# EAGLE design boomdsp (EAGLE 8.1.0)

## Sheet 1 of 2
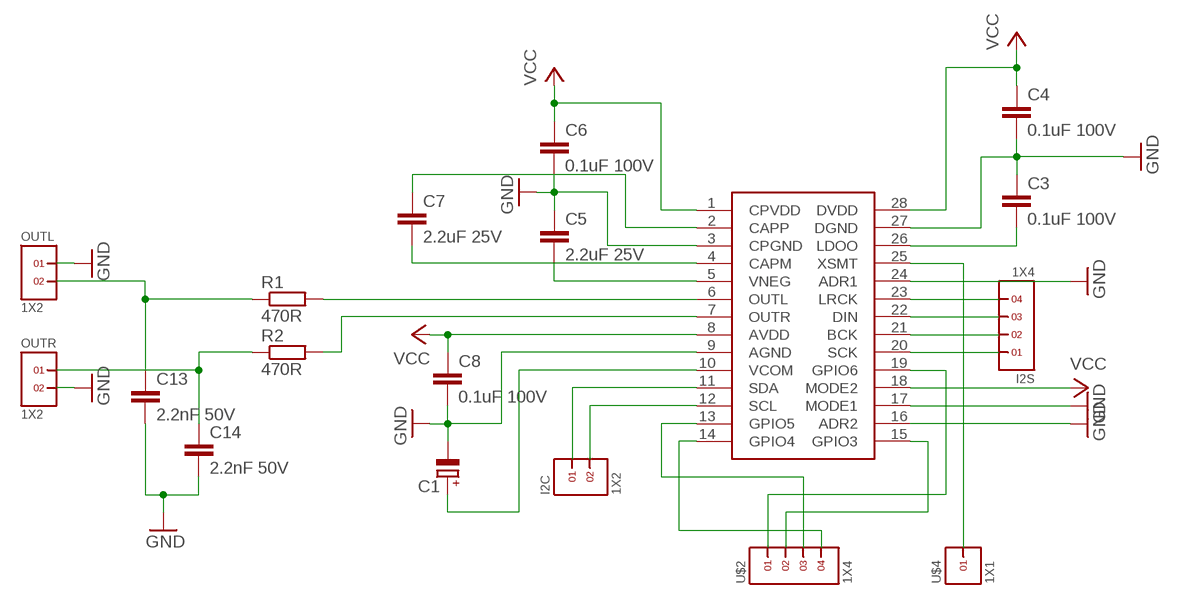
[diagram p0: schematic, sheet 1]

### Parts
C1  CPOL-EUE3.5-8  [E3,5-8]
C3  0.1uF 100V  C-EUC0805  [C0805]
C4  0.1uF 100V  C-EUC0805  [C0805]
C5  2.2uF 25V  C-EUC0805  [C0805]
C6  0.1uF 100V  C-EUC0805  [C0805]
C7  2.2uF 25V  C-EUC0805  [C0805]
C8  0.1uF 100V  C-EUC0805  [C0805]
C13  2.2nF 50V  C-EU102-043X133  [C102-043X133]
C14  2.2nF 50V  C-EU102-043X133  [C102-043X133]
I2C  1X2  [1X2]
I2S  1X4  [1X4]
OUTL  1X2  [1X2]
OUTR  1X2  [1X2]
R1  470R  R-EU_R0805  [R0805]
R2  470R  R-EU_R0805  [R0805]
U$1  PCM5142_I2C  [TSSOP28]
U$2  1X4  [1X4]
U$4  1X1  [1X1]

### Nets
GND: C1.- C3.1 C4.2 C5.1 C6.2 C8.2 C13.2 C14.2 OUTL.1 OUTR.2 U$1.3(CPGND) U$1.9(AGND) U$1.16(ADR2) U$1.24(ADR1) U$1.27(DGND) ; also sheet 2
N$1: R1.2 U$1.6(OUTL)
N$2: R2.2 U$1.7(OUTR)
N$3: C14.1 OUTR.1 R2.1
N$4: C13.1 OUTL.2 R1.1
N$5: C7.2 U$1.4(CAPM)
N$6: C3.2 U$1.26(LDOO)
N$7: U$1.15(GPIO3) U$2.2
N$8: U$1.14(GPIO4) U$2.4
N$9: C5.2 U$1.5(VNEG)
N$10: U$1.13(GPIO5) U$2.3
N$11: U$1.19(GPIO6) U$2.1
N$12: C7.1 U$1.2(CAPP)
N$13: I2S.4 U$1.23(LRCK)
N$14: I2S.3 U$1.22(DIN)
N$15: C1.+ U$1.10(VCOM)
N$16: I2S.2 U$1.21(BCK)
N$17: I2S.1 U$1.20(SCK)
N$18: U$1.17(MODE1) ; supply symbol labelled GND
N$19: I2C.1 U$1.11(SDA)
N$20: I2C.2 U$1.12(SCL)
N$21: U$1.25(XSMT) U$4.1
VCC: C4.1 C6.1 C8.1 U$1.1(CPVDD) U$1.8(AVDD) U$1.18(MODE2) U$1.28(DVDD) ; also sheet 2

## Sheet 2 of 2
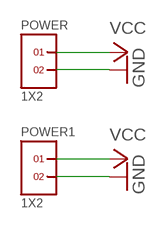
[diagram p1: schematic, sheet 2]

### Parts
POWER  1X2  [1X2]
POWER1  1X2  [1X2]

### Nets
GND: POWER1.2 POWER.2 ; also sheet 1
VCC: POWER1.1 POWER.1 ; also sheet 1

## Library data of the parts
C1 = rcl:CPOL-EU: POLARIZED CAPACITOR, European symbol
C3-C8 C13 C14 = rcl:C-EU: CAPACITOR, European symbol
I2C OUTL OUTR POWER POWER1 = headers(2mm):1X2
I2S U$2 = headers(2mm):1X4
R1 R2 = rcl:R-EU_: RESISTOR, European symbol
U$1 = boomdsp:PCM5142_I2C
U$4 = headers(2mm):1X1

## Board
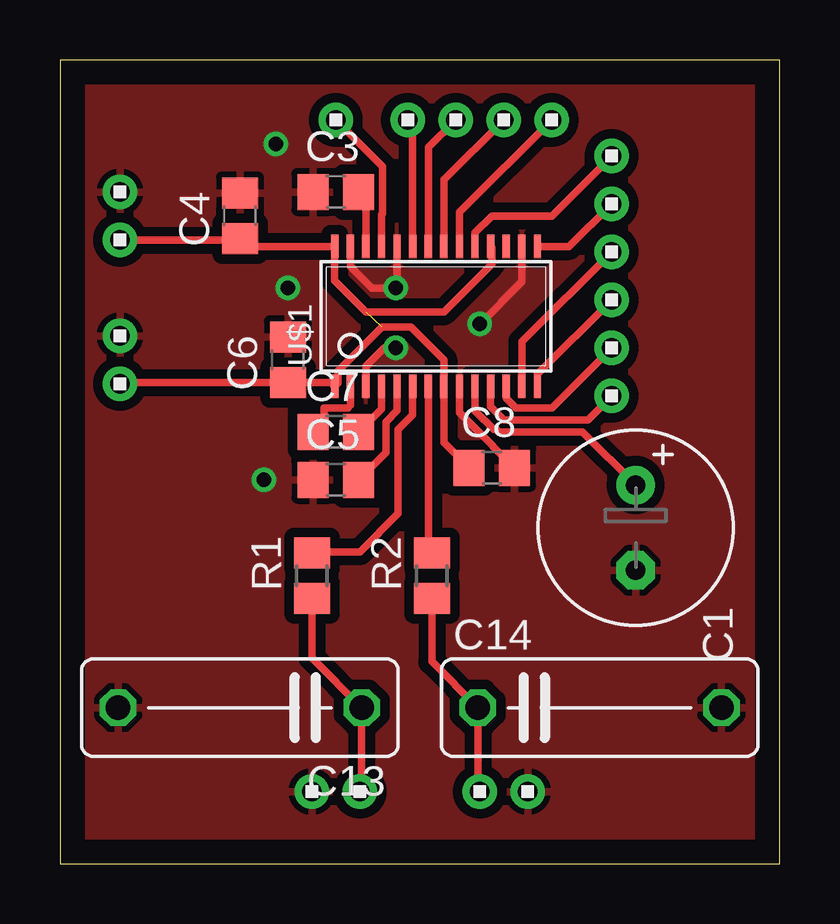
[diagram p2: board, top side]
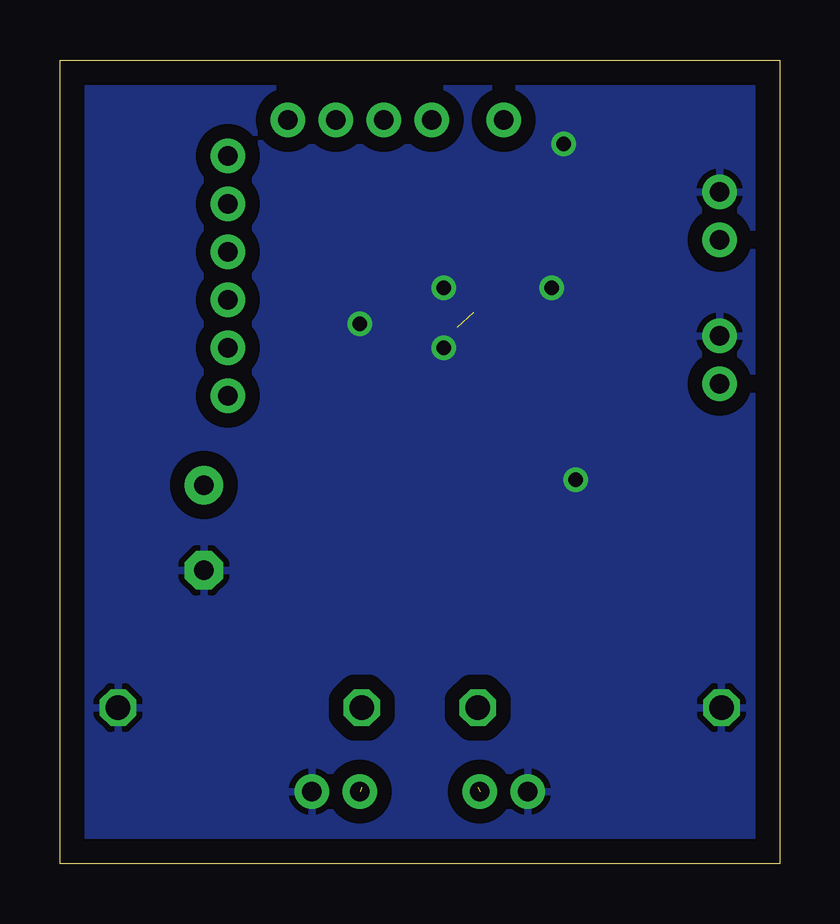
[diagram p3: board, bottom side, seen from below]

Size 30 x 33.5 mm. Coordinates in mm from the lower left corner, seen from the top.
Outline: 0,0 30,0 30,33.5 0,33.5 0,0
Copper layers (1*16): Top 0.035mm / dielectric 1.5mm / Bottom 0.035mm
Design rules "default": minimum track width 10mil, minimum drill 24mil, track to track 8mil, track to pad 8mil, pad to pad 8mil, via to via 8mil, smd to smd 8mil, copper to edge 40mil, drill to drill 8mil, minimum pad ring 10mil, minimum via ring 8mil, stop-mask expansion 4mil, vias tented up to drill 0mil, thermal gap 10mil

### Footprints (pad centres in the part's own frame; a part is rotated, then mirrored left to right if it is on the bottom)
E3,5-8 = drill 0.813 pad 1.6: + -1.778,0 | drill 0.813 pad 1.6 octagon: - 1.778,0
C0805 = smd 1.3 x 1.5: 1 -0.95,0; 2 0.95,0
C102-043X133 = drill 1.016 octagon: 1 -5.08,0; 2 5.08,0
1X2 = drill 0.8 pad 1.422: 1 -1,0; 2 1,0
1X4 = drill 0.8 pad 1.422: 1 -3,0; 2 -1,0; 3 1,0; 4 3,0
R0805 = smd 1.3 x 1.5: 1 -0.95,0; 2 0.95,0
TSSOP28 = smd 0.305 x 0.991: 1 -4.225,-2.918; 2 -3.575,-2.918; 3 -2.925,-2.918; 4 -2.275,-2.918; 5 -1.625,-2.918; 6 -0.975,-2.918; 7 -0.325,-2.918; 8 0.325,-2.918; 9 0.975,-2.918; 10 1.625,-2.918; 11 2.275,-2.918; 12 2.925,-2.918; 13 3.575,-2.918; 14 4.225,-2.918; 15 4.225,2.918; 16 3.575,2.918; 17 2.925,2.918; 18 2.275,2.918; 19 1.625,2.918; 20 0.975,2.918; 21 0.325,2.918; 22 -0.325,2.918; 23 -0.975,2.918; 24 -1.625,2.918; 25 -2.275,2.918; 26 -2.925,2.918; 27 -3.575,2.918; 28 -4.225,2.918
1X1 = drill 0.8 pad 1.422: 1 0,0

### Placement (x,y rotation side)
C1  24,14 270 top
C3  11.5,28 0 top
C4  7.5,27 90 top
C5  11.5,16 0 top
C6  9.5,21 90 top
C7  11.5,18 0 top
C8  18,16.5 0 top
C13  7.5,6.5 180 top
C14  22.5,6.5 0 top
I2C  23,20.5 90 top
I2S  17.5,31 180 top
OUTL  11.5,3 0 top
OUTR  18.5,3 0 top
POWER  2.5,21 90 top
POWER1  2.5,27 90 top
R1  10.5,12 90 top
R2  15.5,12 90 top
U$1  15.68,22.81 0 top
U$2  23,26.5 270 top
U$4  11.5,31 0 top

### Tracks (layer width: path | path; a pad name or v marks a point on that pad's centre or on a via)
GND  (via drill 0.6)
  Top 0.305: C8.2 18.06,17.39 18.06,17.4 16.66,18.8 U$1.9 | U$1.27 12.11,24.89 13,24 v14,24 14.05,24.05 U$1.24 | U$1.16 19.25,24.25 v17.5,22.5 | v14,21.5 13.5,21.5 12.75,20.75 U$1.3
  other vias: 9.5,24 9,30 8.5,16
  pour Top (isolate 0.406): 0,0 30,0 30,33.5 0,33.5
  pour Bottom (isolate 0.61): 0,0 30,0 30,33.5 0,33.5
N$1
  Top 0.305: U$1.6 14.71,18.7 14.09,18.09 14.09,14.59 12.5,13 10.55,13 R1.2
N$2
  Top 0.305: U$1.7 15.36,13.1 R2.2
N$3  (1 unrouted)
  Top 0.305: R2.1 15.5,8.42 C14.1 17.42,3.17
N$4  (1 unrouted)
  Top 0.305: R1.1 10.5,8.58 C13.1 12.58,3.17
N$5
  Top 0.305: C7.2 13.4,18.95 U$1.4
N$6
  Top 0.305: U$1.26 12.76,27.7 C3.2
N$7
  Top 0.305: U$1.15 21.23,25.73 U$2.2
N$8
  Top 0.305: 19.91,19.81 U$1.14 19.91,20.41 U$2.4
N$9
  Top 0.305: U$1.5 14.05,18.89 13.58,18.42 13.58,17.13 C5.2
N$10
  Top 0.305: U$1.13 19.25,21.75 U$2.3
N$11
  Top 0.305: U$1.19 17.3,26.3 18,27 20.5,27 U$2.1
N$12
  Top 0.305: C7.1 11,18.45 11,19 12,19 12.11,19.11 U$1.2
N$13
  Top 0.305: U$1.23 14.71,30.8 I2S.4
N$14
  Top 0.305: U$1.22 15.36,29.86 I2S.3
N$15
  Top 0.305: U$1.10 17.3,18.87 18.09,18.09 18.2,18.09 18.29,17.99 21.79,17.99 C1.+
N$16
  Top 0.305: U$1.21 16,28.5 I2S.2
N$17
  Top 0.305: U$1.20 16.66,27.16 I2S.1
N$19
  Top 0.305: U$1.11 17.95,19.05 18.5,18.5 22,18.5 I2C.1
N$20
  Top 0.305: U$1.12 18.61,19.39 19,19 20.5,19 I2C.2
N$21
  Top 0.305: U$1.25 13.4,27.05 13.46,27.1 13.46,29.04 U$4.1
VCC  (1 unrouted)
  Top 0.305: U$1.18 18,25.68 18,25 16,23 12.75,23 11.46,24.3 U$1.28 7.82,25.73 C4.1 7.45,26 POWER1.1 | C8.1 16,17.55 U$1.8 16,21 14.64,22.36 13.42,22.36 11.6,20.54 11.6,20.03 U$1.1 11.3,20.05 C6.1 2.95,20.05 2.9,20 POWER.1